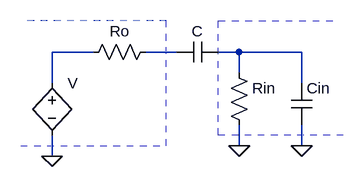
[diagram p0: schematic circuito__2.asc]
circuito__2.asc, the LTspice schematic file:
Version 4
SHEET 1 880 680
WIRE 48 96 -16 96
WIRE 176 96 128 96
WIRE 272 96 240 96
WIRE 368 96 272 96
WIRE 272 128 272 96
WIRE -16 144 -16 96
WIRE 368 144 368 96
WIRE 272 240 272 208
WIRE 368 240 368 208
WIRE -16 256 -16 224
FLAG -16 256 0
FLAG 272 240 0
FLAG 368 240 0
SYMBOL res 32 112 R270
WINDOW 0 32 56 VTop 2
WINDOW 3 0 56 VBottom 2
SYMATTR InstName Ro
SYMATTR Value ""
SYMBOL res 256 112 R0
SYMATTR InstName Rin
SYMATTR Value ""
SYMBOL cap 176 112 R270
WINDOW 0 32 32 VTop 2
WINDOW 3 0 32 VBottom 2
SYMATTR InstName C
SYMATTR Value ""
SYMBOL cap 352 144 R0
SYMATTR InstName Cin
SYMATTR Value ""
SYMBOL bv -16 128 R0
SYMATTR InstName V
SYMATTR Value ""
LINE Normal 160 48 -64 48 3
LINE Normal 160 240 160 48 3
LINE Normal -64 240 160 240 3
LINE Normal 240 48 416 48 3
LINE Normal 240 224 240 48 3
LINE Normal 432 224 240 224 3

The netlist it stands for:
* circuito__2.asc
Ro N001 N002
Rin N003 0
C N002 N003
Cin N003 0
B§V N001 0
.backanno
.end